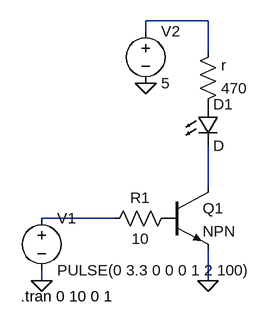
[diagram p0: schematic Transistor LED switch.asc]
Transistor LED switch.asc, the LTspice schematic file:
Version 4
SHEET 1 880 680
WIRE 208 96 112 96
WIRE 112 112 112 96
WIRE 208 144 208 96
WIRE 208 352 208 288
WIRE 64 400 -48 400
WIRE -48 496 -48 480
WIRE 208 496 208 448
FLAG 208 496 0
FLAG 112 192 0
FLAG -48 496 0
SYMBOL voltage -48 384 R0
WINDOW 123 0 0 Left 0
WINDOW 39 0 0 Left 0
SYMATTR InstName V1
SYMATTR Value PULSE(0 3.3 0 0 0 1 2 100)
SYMBOL res 160 384 R90
WINDOW 0 0 56 VBottom 2
WINDOW 3 32 56 VTop 2
SYMATTR InstName R1
SYMATTR Value 10
SYMBOL res 192 240 M180
WINDOW 0 36 76 Left 2
WINDOW 3 36 40 Left 2
SYMATTR InstName r
SYMATTR Value 470
SYMBOL voltage 112 96 R0
WINDOW 123 0 0 Left 0
WINDOW 39 0 0 Left 0
SYMATTR InstName V2
SYMATTR Value 5
SYMBOL npn 144 352 R0
SYMATTR InstName Q1
SYMBOL LED 192 224 R0
SYMATTR InstName D1
TEXT -80 520 Left 2 !.tran 0 10 0 1

The netlist it stands for:
* Transistor LED switch.asc
V1 N003 0 PULSE(0 3.3 0 0 0 1 2 100)
R1 P001 N003 10
r P002 N001 470
V2 N001 0 5
Q1 N002 P001 0 0 NPN
D1 P002 N002 D
.model D D
.lib standard.dio
.model NPN NPN
.model PNP PNP
.lib standard.bjt
.tran 0 10 0 1
.backanno
.end